# Altium schematic sheet schCambiennhietdotestboard_ver2.SchDoc
size A3
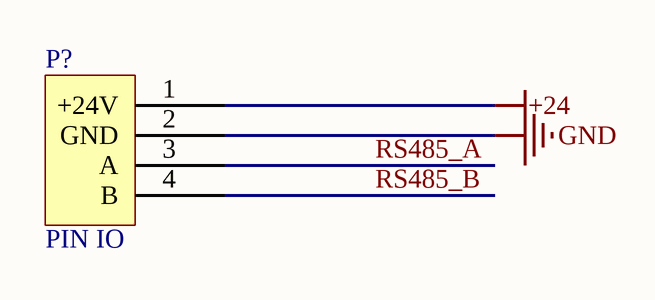
[diagram p0: schCambiennhietdotestboard_ver2.SchDoc]

## Parts
P?  PIN IO  [pcbLibPIN1]

## Nets
+24: P?.1(+24V)
GND: P?.2(GND)
RS485_A: P?.3(A)
RS485_B: P?.4(B)

## Library data of the parts
P? = PIN: Input source 24V and RS485pin